# EAGLE design shebon_heart (EAGLE 7.7.0)
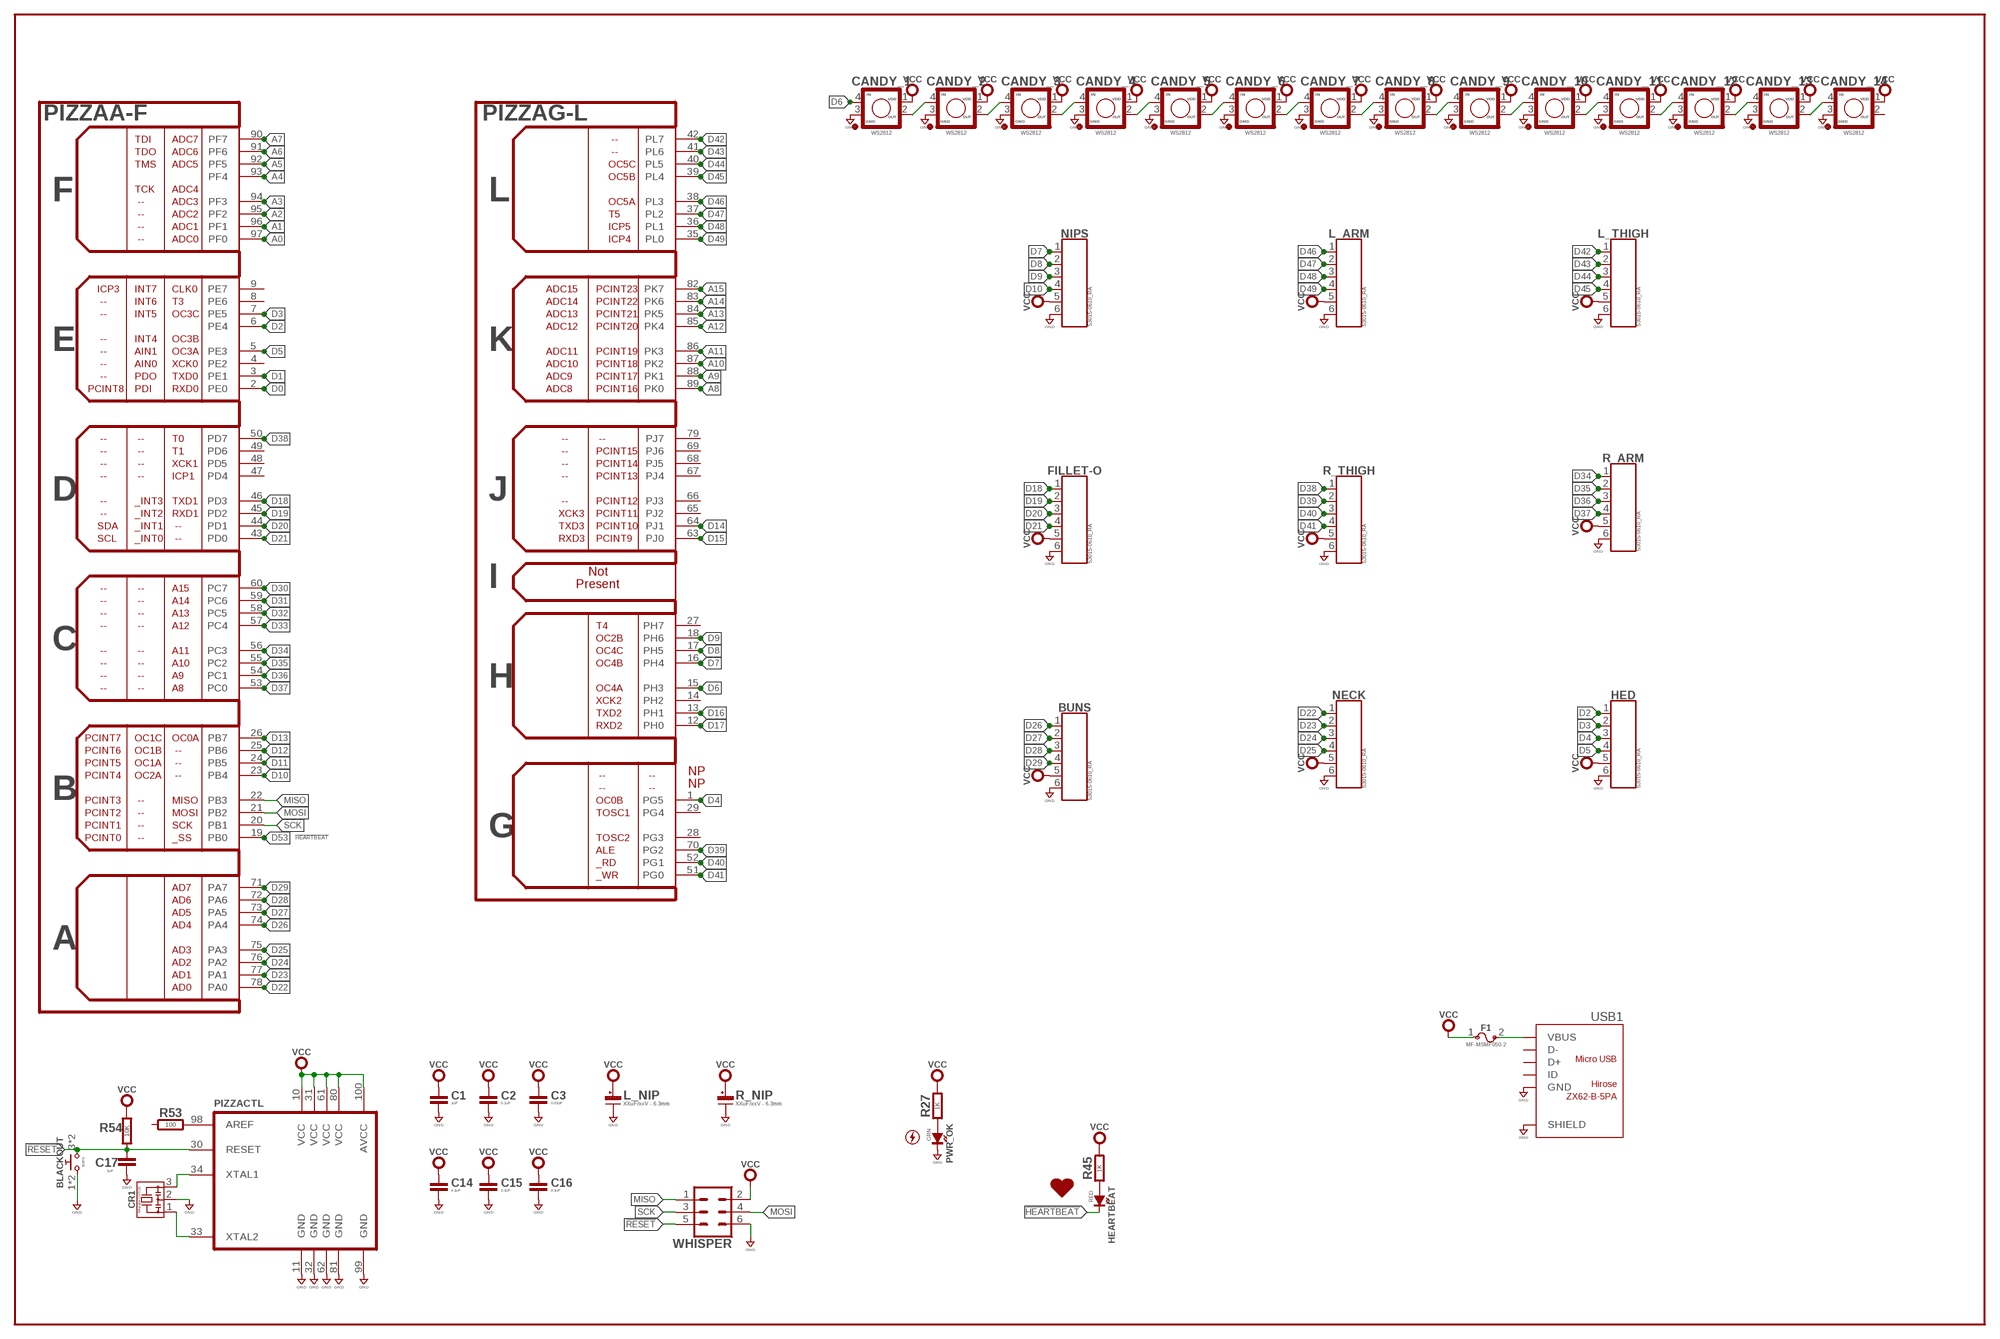
[diagram p0: schematic, sheet 1]
U$1 (TABL_L-BMG): DOCUMENT_NUMBER: BMG-IWALL-V2-A; REV: A

## Parts
BLACKOUT  B3FS  PUSHBTN-MOMB3FS  [B3FS]
BUNS  53015-0610_RA  [MICROBLADE-RA-06P]
C1  1uF  CAPACITOR0603  [0603]
C2  0.1uF  CAPACITOR0603  [0603]
C3  0.01uF  CAPACITOR0603  [0603]
C14  0.1uF  CAPACITOR0603  [0603]
C15  0.1uF  CAPACITOR0603  [0603]
C16  0.1uF  CAPACITOR0603  [0603]
C17  1uF  CAPACITOR0603  [0603]
CANDY_1  WS2812  NEOPPIXEL5X5  [NEOPIXEL]
CANDY_2  WS2812  NEOPPIXEL5X5  [NEOPIXEL]
CANDY_3  WS2812  NEOPPIXEL5X5  [NEOPIXEL]
CANDY_4  WS2812  NEOPPIXEL5X5  [NEOPIXEL]
CANDY_5  WS2812  NEOPPIXEL5X5  [NEOPIXEL]
CANDY_6  WS2812  NEOPPIXEL5X5  [NEOPIXEL]
CANDY_7  WS2812  NEOPPIXEL5X5  [NEOPIXEL]
CANDY_8  WS2812  NEOPPIXEL5X5  [NEOPIXEL]
CANDY_9  WS2812  NEOPPIXEL5X5  [NEOPIXEL]
CANDY_10  WS2812  NEOPPIXEL5X5  [NEOPIXEL]
CANDY_11  WS2812  NEOPPIXEL5X5  [NEOPIXEL]
CANDY_12  WS2812  NEOPPIXEL5X5  [NEOPIXEL]
CANDY_13  WS2812  NEOPPIXEL5X5  [NEOPIXEL]
CANDY_14  WS2812  NEOPPIXEL5X5  [NEOPIXEL]
CR1  Murata CSTCE  RESONATORMURATA-CSTCE  [MURATA_CSTCE]
F1  MF-MSMF050-2  FUSEBOURNS-MF-MSMF  [BOURNS-MF-MSMF]
FILLET-O  53015-0610_RA  [MICROBLADE-RA-06P]
HEARTBEAT  RED  SMT0603  [SMD_0603]
HED  53015-0610_RA  [MICROBLADE-RA-06P]
L_ARM  53015-0610_RA  [MICROBLADE-RA-06P]
L_NIP  XXuF/xxV - 6.3mm  CAPACITOR_POL-ALUM-SMT-6.3  [CAP_ALUM_SMT_6.3]
L_THIGH  53015-0610_RA  [MICROBLADE-RA-06P]
NECK  53015-0610_RA  [MICROBLADE-RA-06P]
NIPS  53015-0610_RA  [MICROBLADE-RA-06P]
PIZZA  ATMEGA-2560  [TQFP-100-A]
PWR_OK  GRN  SMT0603  [SMD_0603]
R27  1K  RESISTOR0603  [0603]
R45  1K  RESISTOR0603  [0603]
R53  100  RESISTOR0603  [0603]
R54  10K  RESISTOR0603  [0603]
R_ARM  53015-0610_RA  [MICROBLADE-RA-06P]
R_NIP  XXuF/xxV - 6.3mm  CAPACITOR_POL-ALUM-SMT-6.3  [CAP_ALUM_SMT_6.3]
R_THIGH  53015-0610_RA  [MICROBLADE-RA-06P]
U$2  ELECTRICITY-050X050MM  [ELECTRICITY-GLYPH-05X05MM]
U$3  HEART-05X04MM  [HEART-GLYPH-05X04MM]
USB1  ZX62-B-5PA  MICRO-USB-SMD(ZX62-B-5PA)  [MICRO-USB5+6P-SMD-0.65-AB]
WHISPER  MA03-2  [MA03-2]

## Nets
!HEARTBEAT: HEARTBEAT.K(C)
!RESET: BLACKOUT.3 BLACKOUT.4 C17.1 PIZZA.30(CTL:RESET) R54.2 WHISPER.5
A0: PIZZA.97(A-F:PF0)
A1: PIZZA.96(A-F:PF1)
A2: PIZZA.95(A-F:PF2)
A3: PIZZA.94(A-F:PF3)
A4: PIZZA.93(A-F:PF4)
A5: PIZZA.92(A-F:PF5)
A6: PIZZA.91(A-F:PF6)
A7: PIZZA.90(A-F:PF7)
A8: PIZZA.89(G-L:PK0)
A9: PIZZA.88(G-L:PK1)
A10: PIZZA.87(G-L:PK2)
A11: PIZZA.86(G-L:PK3)
A12: PIZZA.85(G-L:PK4)
A13: PIZZA.84(G-L:PK5)
A14: PIZZA.83(G-L:PK6)
A15: PIZZA.82(G-L:PK7)
D0: PIZZA.2(A-F:PE0)
D1: PIZZA.3(A-F:PE1)
D2: HED.1 PIZZA.6(A-F:PE4)
D3: HED.2 PIZZA.7(A-F:PE5)
D4: HED.3 PIZZA.1(G-L:PG5)
D5: HED.4 PIZZA.5(A-F:PE3)
D6: CANDY_1.4(OUT) PIZZA.15(G-L:PH3)
D7: NIPS.1 PIZZA.16(G-L:PH4)
D8: NIPS.2 PIZZA.17(G-L:PH5)
D9: NIPS.3 PIZZA.18(G-L:PH6)
D10: NIPS.4 PIZZA.23(A-F:PB4)
D11: PIZZA.24(A-F:PB5)
D12: PIZZA.25(A-F:PB6)
D13: PIZZA.26(A-F:PB7)
D14: PIZZA.64(G-L:PJ1)
D15: PIZZA.63(G-L:PJ0)
D16: PIZZA.13(G-L:PH1)
D17: PIZZA.12(G-L:PH0)
D18: FILLET-O.1 PIZZA.46(A-F:PD3)
D19: FILLET-O.2 PIZZA.45(A-F:PD2)
D20: FILLET-O.3 PIZZA.44(A-F:PD1)
D21: FILLET-O.4 PIZZA.43(A-F:PD0)
D22: NECK.1 PIZZA.78(A-F:PA0)
D23: NECK.2 PIZZA.77(A-F:PA1)
D24: NECK.3 PIZZA.76(A-F:PA2)
D25: NECK.4 PIZZA.75(A-F:PA3)
D26: BUNS.1 PIZZA.74(A-F:PA4)
D27: BUNS.2 PIZZA.73(A-F:PA5)
D28: BUNS.3 PIZZA.72(A-F:PA6)
D29: BUNS.4 PIZZA.71(A-F:PA7)
D30: PIZZA.60(A-F:PC7)
D31: PIZZA.59(A-F:PC6)
D32: PIZZA.58(A-F:PC5)
D33: PIZZA.57(A-F:PC4)
D34: PIZZA.56(A-F:PC3) R_ARM.1
D35: PIZZA.55(A-F:PC2) R_ARM.2
D36: PIZZA.54(A-F:PC1) R_ARM.3
D37: PIZZA.53(A-F:PC0) R_ARM.4
D38: PIZZA.50(A-F:PD7) R_THIGH.1
D39: PIZZA.70(G-L:PG2) R_THIGH.2
D40: PIZZA.52(G-L:PG1) R_THIGH.3
D41: PIZZA.51(G-L:PG0) R_THIGH.4
D42: L_THIGH.1 PIZZA.42(G-L:PL7)
D43: L_THIGH.2 PIZZA.41(G-L:PL6)
D44: L_THIGH.3 PIZZA.40(G-L:PL5)
D45: L_THIGH.4 PIZZA.39(G-L:PL4)
D46: L_ARM.1 PIZZA.38(G-L:PL3)
D47: L_ARM.2 PIZZA.37(G-L:PL2)
D48: L_ARM.3 PIZZA.36(G-L:PL1)
D49: L_ARM.4 PIZZA.35(G-L:PL0)
D53: PIZZA.19(A-F:PB0)
GND: BLACKOUT.1 BLACKOUT.2 BUNS.6 C1.2 C2.2 C3.2 C14.2 C15.2 C16.2 C17.2 CANDY_1.3(GND) CANDY_2.3(GND) CANDY_3.3(GND) CANDY_4.3(GND) CANDY_5.3(GND) CANDY_6.3(GND) CANDY_7.3(GND) CANDY_8.3(GND) CANDY_9.3(GND) CANDY_10.3(GND) CANDY_11.3(GND) CANDY_12.3(GND) CANDY_13.3(GND) CANDY_14.3(GND) CR1.2 FILLET-O.6 HED.6 L_ARM.6 L_NIP.-(N) L_THIGH.6 NECK.6 NIPS.6 PIZZA.11(CTL:GND) PIZZA.32(CTL:GND) PIZZA.62(CTL:GND) PIZZA.81(CTL:GND) PIZZA.99(CTL:GND) PWR_OK.K(C) R_ARM.6 R_NIP.-(N) R_THIGH.6 USB1.5(GND) USB1.P1(SHIELD) USB1.P2(SHIELD) USB1.P3_1(SHIELD) USB1.P3_2(SHIELD) USB1.P3_3(SHIELD) USB1.P4_1(SHIELD) USB1.P4_2(SHIELD) USB1.P4_3(SHIELD) USB1.P5(SHIELD) USB1.P6(SHIELD) WHISPER.6
MISO: PIZZA.22(A-F:PB3) WHISPER.1
MOSI: PIZZA.21(A-F:PB2) WHISPER.4
N$2: CR1.3 PIZZA.34(CTL:XTAL1)
N$3: CR1.1 PIZZA.33(CTL:XTAL2)
N$4: CANDY_1.2(IN) CANDY_2.4(OUT)
N$5: CANDY_2.2(IN) CANDY_3.4(OUT)
N$6: CANDY_3.2(IN) CANDY_4.4(OUT)
N$7: CANDY_4.2(IN) CANDY_5.4(OUT)
N$8: CANDY_5.2(IN) CANDY_6.4(OUT)
N$9: CANDY_6.2(IN) CANDY_7.4(OUT)
N$10: CANDY_7.2(IN) CANDY_8.4(OUT)
N$11: CANDY_8.2(IN) CANDY_9.4(OUT)
N$12: CANDY_9.2(IN) CANDY_10.4(OUT)
N$13: CANDY_10.2(IN) CANDY_11.4(OUT)
N$14: CANDY_11.2(IN) CANDY_12.4(OUT)
N$15: CANDY_12.2(IN) CANDY_13.4(OUT)
N$16: CANDY_13.2(IN) CANDY_14.4(OUT)
N$36: PWR_OK.A R27.1
N$41: HEARTBEAT.A R45.1
N$79: PIZZA.98(CTL:AREF) R53.2
SCK: PIZZA.20(A-F:PB1) WHISPER.3
VBUS: F1.2 USB1.1(VBUS)
VCC: BUNS.5 C1.1 C2.1 C3.1 C14.1 C15.1 C16.1 CANDY_1.1(VDD) CANDY_2.1(VDD) CANDY_3.1(VDD) CANDY_4.1(VDD) CANDY_5.1(VDD) CANDY_6.1(VDD) CANDY_7.1(VDD) CANDY_8.1(VDD) CANDY_9.1(VDD) CANDY_10.1(VDD) CANDY_11.1(VDD) CANDY_12.1(VDD) CANDY_13.1(VDD) CANDY_14.1(VDD) F1.1 FILLET-O.5 HED.5 L_ARM.5 L_NIP.+(P) L_THIGH.5 NECK.5 NIPS.5 PIZZA.10(CTL:VCC) PIZZA.31(CTL:VCC) PIZZA.61(CTL:VCC) PIZZA.80(CTL:VCC) PIZZA.100(CTL:AVCC) R27.2 R45.2 R54.1 R_ARM.5 R_NIP.+(P) R_THIGH.5 WHISPER.2
Unconnected: CANDY_14.2(IN) PIZZA.4(A-F:PE2) PIZZA.8(A-F:PE6) PIZZA.9(A-F:PE7) PIZZA.14(G-L:PH2) PIZZA.27(G-L:PH7) PIZZA.28(G-L:PG3) PIZZA.29(G-L:PG4) PIZZA.47(A-F:PD4) PIZZA.48(A-F:PD5) PIZZA.49(A-F:PD6) PIZZA.65(G-L:PJ2) PIZZA.66(G-L:PJ3) PIZZA.67(G-L:PJ4) PIZZA.68(G-L:PJ5) PIZZA.69(G-L:PJ6) PIZZA.79(G-L:PJ7) R53.1 USB1.2(D-) USB1.3(D+) USB1.4(ID)

## Notes on the sheet
- !HEARTBEAT

## Library data of the parts
BLACKOUT = switch-smd:PUSHBTN-MOM: Pushbutton Switch
BUNS FILLET-O HED L_ARM L_THIGH NECK NIPS R_ARM R_THIGH = robicon-connectors-m:5301*-0610: Molex, Microblade, 6-pin
C1-C3 C14-C17 = rlc:CAPACITOR: Capacitor CAP
CANDY_1-CANDY_14 = led:NEOPPIXEL: Adafruit NeoPixel
CR1 = ceramic-resonators:RESONATOR: resonator xtal
F1 = fuse:FUSE: Fuse
HEARTBEAT PWR_OK = led:SMT: LED SMT 0603 0805 1206
L_NIP R_NIP = rlc:CAPACITOR_POL: Polarized Capacitor
PIZZA = atmel-atmega:ATMEGA-*0: Atmel ATmega 640/1280/2560
R27 R45 R53 R54 = rlc:RESISTOR: Resistor
U$2 = gfx-glyphs:ELECTRICITY
U$3 = gfx-glyphs:HEART
USB1 = Seeed-Connector:MICRO-USB-SMD(ZX62-B-5PA): 320010005; MPN: ZX62-B-5PA
WHISPER = con-headers:MA03-2: PIN HEADER

## Board
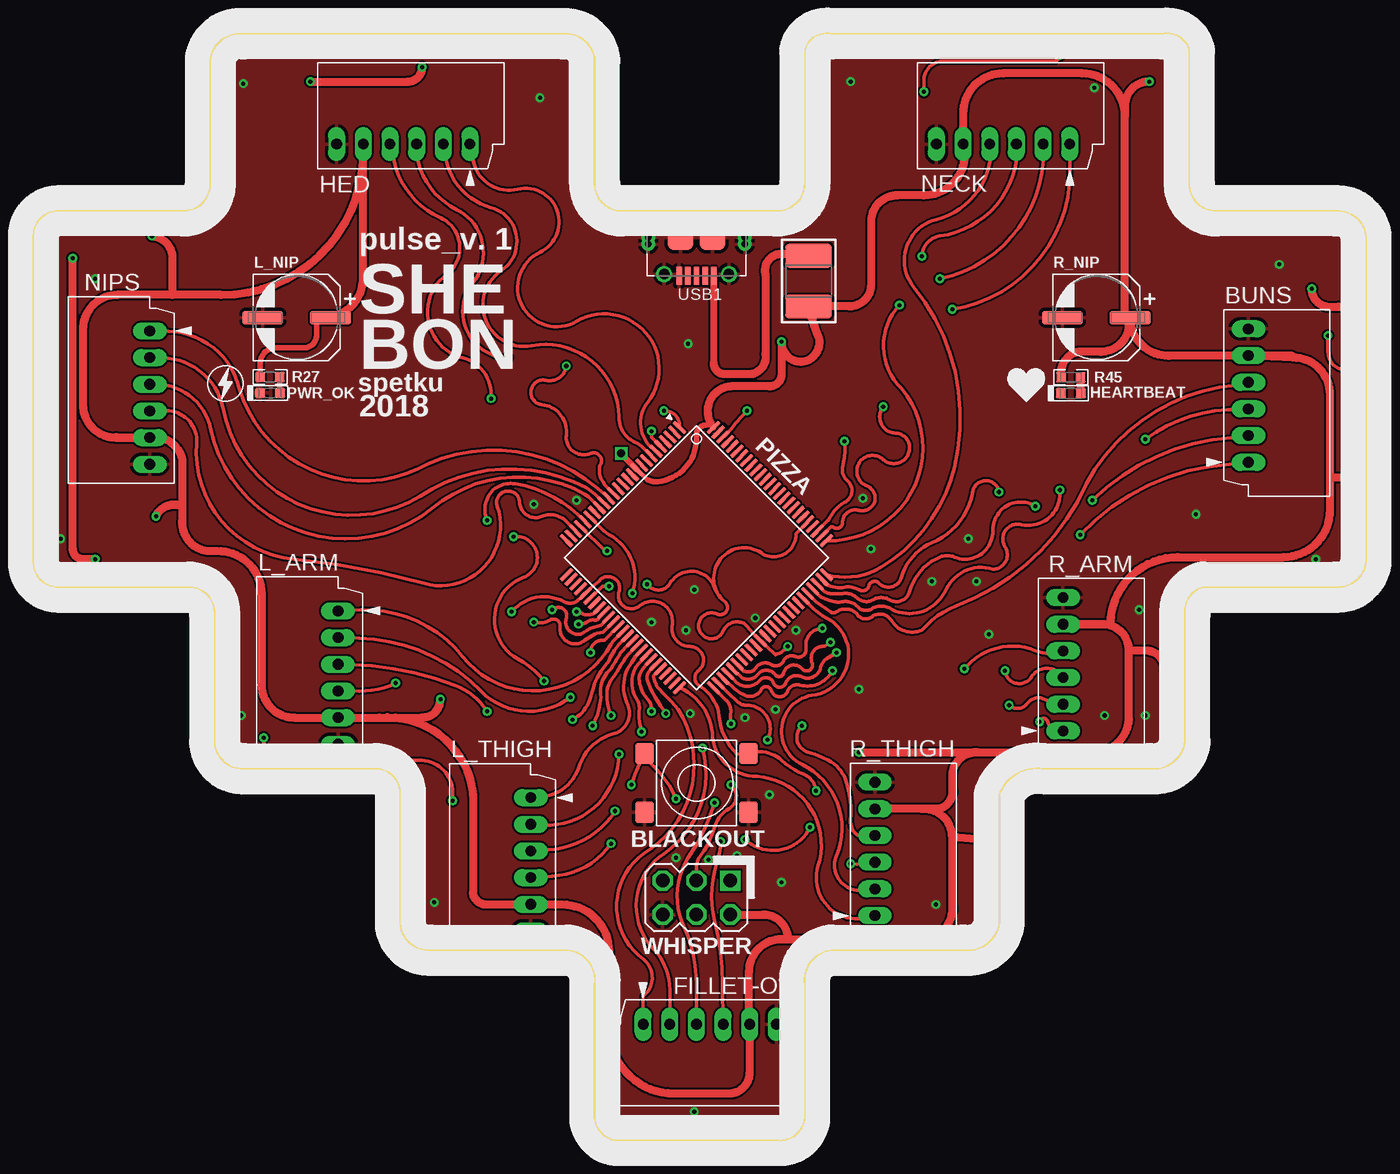
[diagram p1: board, top side]
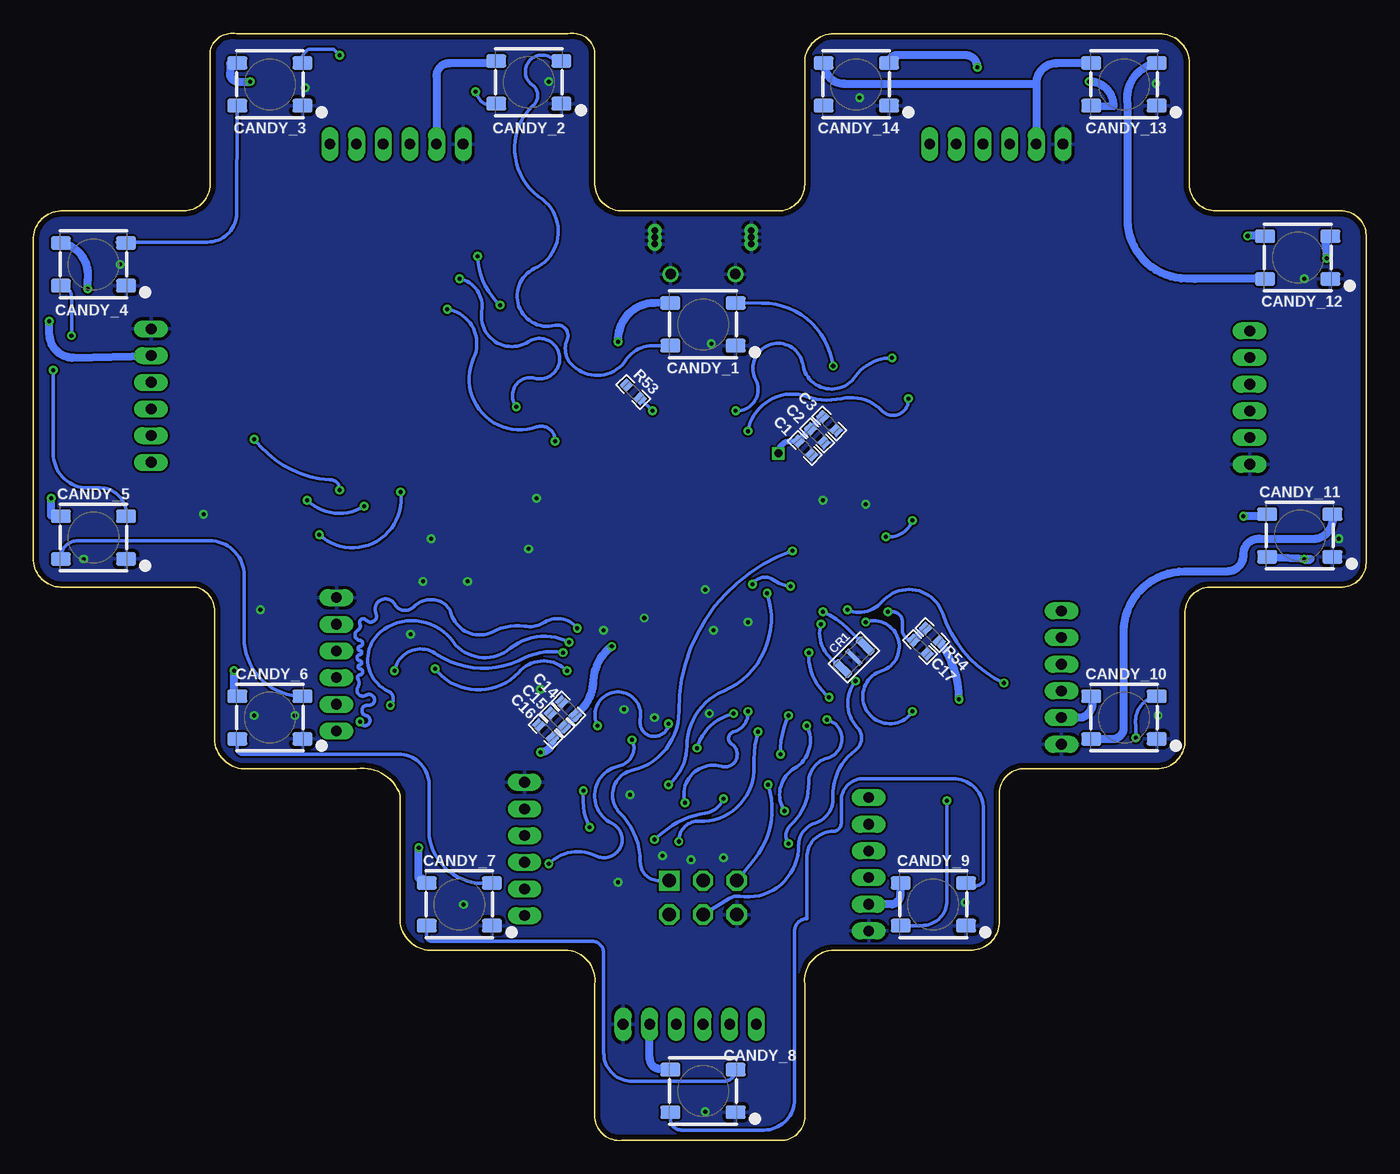
[diagram p2: board, bottom side, seen from below]

Size 100 x 83.04 mm. Coordinates in mm from the lower left corner, seen from the top.
Outline: 88.74,69.73 arc-90 86.74,71.72 86.74,81.72 arc90 84.74,83.01 59.88,83.01 arc90 57.88,81.72 57.88,71.73 arc-90 55.76,69.72 44.13,69.72 arc-90 42.13,71.73 42.13,81.01 arc90 39.76,83.01 15.76,83.01 arc90 13.27,81.01 13.27,71.72 arc-90 11.27,69.73 1.76,69.73 arc90 0,67.73 0,43.51 arc90 1.76,41.51 11.76,41.51 arc-90 13.6,39.51 13.6,29.89 arc90 15.76,27.89 25.76,27.89 arc-90 27.53,25.89 27.53,16.28 arc90 29.76,14.28 40.13,14.28 arc-90 42.13,11.72 42.13,2.01 arc90 43.76,0.01 55.88,0.01 arc90 57.88,1.72 57.88,11.72 arc-90 59.88,14.28 69.76,14.28 arc90 72.47,16.28 72.47,25.89 arc-80 75.76,27.89 83.76,27.89 arc90 86.4,29.89 86.4,39.51 arc-80 87.76,41.51 97.76,41.51 arc90 100,43.51 100,67.73 arc90 97.76,69.73 88.74,69.73
Copper layers (1*16): Top 0.0356mm / dielectric 1.5011mm / Bottom 0.0356mm
Design rules "OSH-CircuitMonkey *": minimum track width 6mil, minimum drill 12mil, track to track 6mil, track to pad 6mil, pad to pad 6mil, via to via 6mil, smd to smd 6mil, copper to edge 15mil, drill to drill 6mil, minimum pad ring 7mil, minimum via ring 7mil, stop-mask expansion 3mil, vias tented up to drill 13mil, thermal gap 10mil

### Footprints (pad centres in the part's own frame; a part is rotated, then mirrored left to right if it is on the bottom)
B3FS = smd 1.4 x 1.6: 1 3.9,-2.2; 2 -3.9,-2.2; 3 3.9,2.2; 4 -3.9,2.2
MICROBLADE-RA-06P = drill 0.8 pad 1.27 long: 1 0,0; 2 0,-2; 3 0,-4; 4 0,-6; 5 0,-8; 6 0,-10
0603 = smd 0.762 x 0.762: 1 -0.725,0; 2 0.725,0
NEOPIXEL = smd 1.5 x 1: 1 -2.45,1.6; 2 -2.45,-1.6; 3 2.45,-1.6; 4 2.45,1.6
MURATA_CSTCE = smd 0.6 x 1.6: 1 -1.2,0; 3 1.2,0 | smd 0.4 x 1.6: 2 0,0
BOURNS-MF-MSMF = smd 1.8 x 3.5: 1 -1.9,0; 2 1.9,0
SMD_0603 = smd 0.8 x 0.8: A 0.75,0; K -0.75,0
CAP_ALUM_SMT_6.3 = smd 3.048 x 1.016: + 2.54,0; - -2.54,0
TQFP-100-A = smd 1.2 x 0.28: 1 -7.8,6; 2 -7.8,5.5; 3 -7.8,5; 4 -7.8,4.5; 5 -7.8,4; 6 -7.8,3.5; 7 -7.8,3; 8 -7.8,2.5; 9 -7.8,2; 10 -7.8,1.5; 11 -7.8,1; 12 -7.8,0.5; 13 -7.8,0; 14 -7.8,-0.5; 15 -7.8,-1; 16 -7.8,-1.5; 17 -7.8,-2; 18 -7.8,-2.5; 19 -7.8,-3; 20 -7.8,-3.5; 21 -7.8,-4; 22 -7.8,-4.5; 23 -7.8,-5; 24 -7.8,-5.5; 25 -7.8,-6; 51 7.8,-6; 52 7.8,-5.5; 53 7.8,-5; 54 7.8,-4.5; 55 7.8,-4; 56 7.8,-3.5; 57 7.8,-3; 58 7.8,-2.5; 59 7.8,-2; 60 7.8,-1.5; 61 7.8,-1; 62 7.8,-0.5; 63 7.8,0; 64 7.8,0.5; 65 7.8,1; 66 7.8,1.5; 67 7.8,2; 68 7.8,2.5; 69 7.8,3; 70 7.8,3.5; 71 7.8,4; 72 7.8,4.5; 73 7.8,5; 74 7.8,5.5; 75 7.8,6 | smd 0.28 x 1.2: 26 -6,-7.8; 27 -5.5,-7.8; 28 -5,-7.8; 29 -4.5,-7.8; 30 -4,-7.8; 31 -3.5,-7.8; 32 -3,-7.8; 33 -2.5,-7.8; 34 -2,-7.8; 35 -1.5,-7.8; 36 -1,-7.8; 37 -0.5,-7.8; 38 0,-7.8; 39 0.5,-7.8; 40 1,-7.8; 41 1.5,-7.8; 42 2,-7.8; 43 2.5,-7.8; 44 3,-7.8; 45 3.5,-7.8; 46 4,-7.8; 47 4.5,-7.8; 48 5,-7.8; 49 5.5,-7.8; 50 6,-7.8; 76 6,7.8; 77 5.5,7.8; 78 5,7.8; 79 4.5,7.8; 80 4,7.8; 81 3.5,7.8; 82 3,7.8; 83 2.5,7.8; 84 2,7.8; 85 1.5,7.8; 86 1,7.8; 87 0.5,7.8; 88 0,7.8; 89 -0.5,7.8; 90 -1,7.8; 91 -1.5,7.8; 92 -2,7.8; 93 -2.5,7.8; 94 -3,7.8; 95 -3.5,7.8; 96 -4,7.8; 97 -4.5,7.8; 98 -5,7.8; 99 -5.5,7.8; 100 -6,7.8
MICRO-USB5+6P-SMD-0.65-AB = smd 0.4 x 1.35: 1 -1.3,2.875; 2 -0.65,2.875; 3 0,2.875; 4 0.65,2.875; 5 1.3,2.875 | smd 1.9 x 1.9: P1 -1.2,0; P2 1.2,0 | drill 0.508 pad 1.016: P3_1 -3.625,-0.533; P3_2 -3.625,-0.025; P3_3 -3.625,0.483; P4_1 3.625,-0.533; P4_2 3.625,-0.025; P4_3 3.625,0.483 | drill 0.8: P5 -2.425,2.73; P6 2.425,2.73
MA03-2 = drill 1.016 square: 1 -2.54,-1.27 | drill 1.016 octagon: 2 -2.54,1.27; 3 0,-1.27; 4 0,1.27; 5 2.54,-1.27; 6 2.54,1.27

### Placement (x,y rotation side)
BLACKOUT  49.76,26.82 0 top
BUNS  91.17,50.87 180 top
C1  42.11,51.95 315 bottom
C2  41.2,52.87 315 bottom
C3  40.28,53.79 315 bottom
C14  59.85,32.39 135 bottom
C15  60.69,31.54 135 bottom
C16  61.57,30.67 135 bottom
C17  33.47,37.01 315 bottom
CANDY_1  49.76,61.22 0 bottom
CANDY_2  62.82,79.37 0 bottom
CANDY_3  82.26,79.22 0 bottom
CANDY_4  95.49,65.72 0 bottom
CANDY_5  95.49,45.22 0 bottom
CANDY_6  82.26,31.72 0 bottom
CANDY_7  68.04,17.72 0 bottom
CANDY_8  49.76,3.72 0 bottom
CANDY_9  32.48,17.72 0 bottom
CANDY_10  18.17,31.72 0 bottom
CANDY_11  4.98,45.37 0 bottom
CANDY_12  5.13,66.22 0 bottom
CANDY_13  18.17,79.22 0 bottom
CANDY_14  38.26,79.22 0 bottom
CR1  38.43,36.24 225 bottom
F1  58.17,64.46 90 top
FILLET-O  45.76,8.72 90 top
HEARTBEAT  77.85,56.05 0 top
HED  32.76,74.74 270 top
L_ARM  22.87,39.72 0 top
L_NIP  19.76,61.72 0 top
L_THIGH  37.32,25.72 0 top
NECK  77.76,74.74 270 top
NIPS  8.74,60.72 0 top
PIZZA  49.76,43.72 315 top
PWR_OK  17.76,56.07 0 top
R27  17.76,57.26 180 top
R45  77.85,57.25 180 top
R53  54.99,56.15 315 bottom
R54  32.55,37.93 135 bottom
R_ARM  77.26,30.72 180 top
R_NIP  79.76,61.72 0 top
R_THIGH  63.15,16.87 180 top
U$2  14.4,56.79 0 top
U$3  74.49,56.75 0 top
USB1  49.76,67.72 180 top
WHISPER  49.76,18.22 180 top

### Tracks (layer width: path | path; a pad name or v marks a point on that pad's centre or on a via)
!RESET  (via drill 0.3)
  Top 0.254: v44.87,26.7 arc-10 BLACKOUT.4 45.86,28.75 46.7,27.91 arc-23 v48.22,25.63 | v53.4,22.58 arc107 v58.28,23.5 | v58.74,26.24 arc60 57.82,27.46 arc-18 56.14,28.52 arc61 BLACKOUT.3 52.79,28.98 arc-43 51.42,32.18 arc44 49.9,34.16 arc-103 49.9,35.23 arc139 49.29,37.06 arc-98 47.91,38.58 arc143 45.48,40.11 arc-149 43.95,41.17 arc162 42.43,41.94 arc7 PIZZA.30 41.37,41.03 40.9,40.56 arc-74 39.84,40.41 arc78 v35.88,39.65
  Bottom 0.254: WHISPER.5 45.93,21.06 arc-57 v44.87,26.7 | v48.22,25.63 arc59 49.59,24.56 arc-25 52.03,23.65 arc-10 v53.4,22.58 | v58.28,23.5 arc33 v58.74,26.24 | v35.88,39.65 35.72,39.65 arc90 34.81,39.04 34.81,38.35 arc-90 C17.1
  Bottom 0.61: R54.2 C17.1
D2
  Top 0.254: HED.1 32.98,73.79 arc99 36.33,71.35 arc-168 38.01,66.62 arc185 40.75,61.44 arc-158 46.09,55.35 arc96 PIZZA.6
D3
  Top 0.254: HED.2 30.85,74.4 arc72 34.35,69.98 arc-131 35.11,65.25 arc157 37.4,59.61 arc-99 43.95,54.28 arc74 45.32,52.3 45.63,52.09 PIZZA.7
D4  (via drill 0.3)
  Top 0.254: HED.3 28.71,74.85 arc65 31.76,69.82 arc-103 32.98,64.34 arc127 v35.57,58.7 | v47.31,54.74 arc-101 PIZZA.1
  Bottom 0.254: v35.57,58.7 arc-54 38.31,57.33 arc138 42.28,58.24 arc-198 45.78,57.02 arc119 v47.31,54.74
D5  (via drill 0.3)
  Top 0.254: HED.4 26.88,74.55 arc62 30.54,69.22 arc-119 31,64.95 arc129 32.22,58.7 arc-81 v34.35,55.65 | v46.39,53.21 46.39,52.74 PIZZA.5
  Bottom 0.254: v34.35,55.65 arc141 36.33,54.74 arc-58 39.38,55.65 arc32 41.97,55.8 arc-99 v46.39,53.21
D6  (via drill 0.3)
  Top 0.254: v39.99,58.09 arc-96 38.47,57.02 arc187 38.16,55.19 arc-91 39.99,52.91 arc120 41.82,51.54 arc-136 42.58,50.77 arc59 42.73,49.4 arc14 PIZZA.15
  Bottom 0.254: CANDY_1.4 45.32,62.81 arc83 v39.99,58.09
D7
  Top 0.254: NIPS.1 10.12,60.68 arc-76 15.45,56.41 arc103 29.63,50.77 arc-68 PIZZA.16
D8
  Top 0.254: NIPS.2 9.66,58.7 arc-79 14.23,54.89 arc111 29.02,48.34 arc-61 41.51,48.95 42.16,48.49 PIZZA.17
D9
  Top 0.254: NIPS.3 9.21,56.72 arc-78 13.32,53.37 arc117 29.93,47.42 arc-69 41.36,48.49 41.67,48.28 PIZZA.18
D10
  Top 0.254: NIPS.4 9.97,54.74 arc-95 12.25,52.3 arc89 19.57,43.61 arc-10 29.32,41.78 arc125 34.81,47.57 arc-197 36.48,47.88 arc112 38.16,46.81 arc-58 39.69,46.66 39.75,46.66 PIZZA.23
D18
  Top 0.254: FILLET-O.1 45.76,10.82 45.93,11 arc97 45.78,13.59 arc-108 45.78,21.51 arc92 48.37,32.33 arc1 46.85,34.01 arc-29 46.54,34.77 46.54,34.85 PIZZA.46
D19  (via drill 0.3)
  Top 0.254: FILLET-O.2 47.76,11.3 arc44 46.54,14.35 arc-100 47.31,21.51 arc72 v50.2,29.44 | PIZZA.45 46.24,35.23 arc65 46.09,34.47 arc17 v47.46,32.03
  Bottom 0.254: v50.2,29.44 arc62 v47.46,32.03
D20  (via drill 0.3)
  Top 0.254: FILLET-O.3 49.74,11.61 arc24 48.83,16.03 arc-57 49.13,21.21 arc17 v51.12,25.32 | v46.39,32.18 arc48 46.09,33.1 arc-37 45.48,34.47 arc-49 45.63,35.23 45.93,35.66 PIZZA.44
  Bottom 0.254: v51.12,25.32 arc121 48.37,28.07 arc-163 47.61,29.74 arc133 47.46,30.66 arc-82 v46.39,32.18
D21  (via drill 0.3)
  Top 0.254: FILLET-O.4 51.72,11.76 arc14 51.12,16.48 arc-32 51.27,20.75 arc16 v51.57,22.43 | v45.63,30.66 arc-22 45.48,32.49 arc32 45.17,33.25 arc-41 45.02,35.08 arc-28 45.48,35.84 46.01,36.37 PIZZA.43
  Bottom 0.254: v51.57,22.43 arc95 50.05,23.95 arc-95 45.93,28.07 arc18 v45.63,30.66
D22  (via drill 0.3)
  Top 0.254: NECK.1 77.79,72.72 arc-82 v68.95,62.36 | v60.87,52.45 arc-19 60.72,50.47 arc64 61.02,49.56 arc-117 60.87,47.88 arc35 59.65,46.51 59.61,46.51 PIZZA.78
  Bottom 0.254: v68.95,62.36 arc106 66.96,58.7 arc-134 62.24,53.52 arc114 v60.87,52.45
D23  (via drill 0.3)
  Top 0.254: NECK.2 75.8,74.4 arc-79 v68.03,64.64 | v63.76,55.04 arc127 64.68,53.06 arc-86 65.75,51.99 arc-134 63.76,51.08 arc201 62.55,49.1 arc-175 61.94,47.27 arc106 60.72,46.36 arc-136 59.95,46.05 59.86,46.05 PIZZA.77
  Bottom 0.254: v68.03,64.64 arc88 66.36,62.2 arc-132 62.85,59.92 arc227 62.39,57.18 arc-143 v63.76,55.04
D24  (via drill 0.3)
  Top 0.254: NECK.3 73.82,74.7 arc-84 68.03,67.84 arc81 v66.66,66.32 | v64.98,62.66 arc89 65.14,56.41 arc-132 PIZZA.76
  Bottom 0.254: v66.66,66.32 arc-46 v64.98,62.66
D25
  Top 0.254: NECK.4 71.84,74.55 arc-78 67.73,69.06 arc115 66.05,64.03 arc-53 69.1,50.47 arc-45 63.61,43 arc-47 PIZZA.75
D26  (via drill 0.3)
  Top 0.254: BUNS.1 91.35,50.77 arc48 v78.55,45.44 | v72.45,48.64 arc172 70.47,48.49 arc-55 67.42,44.83 arc51 65.14,42.24 arc-118 63.46,41.78 arc124 62.7,41.63 arc-118 61.94,41.33 arc42 60.72,41.48 arc-26 59.65,41.63 arc-44 PIZZA.74
  Bottom 0.254: v78.55,45.44 arc-142 v72.45,48.64
D27  (via drill 0.3)
  Top 0.254: BUNS.2 91.35,52.76 arc45 v79.46,48.03 | v75.19,47.57 arc123 71.99,45.75 arc-114 69.1,43.76 arc45 68.03,43.76 arc52 65.75,41.17 arc-105 64.22,40.56 arc62 63,40.56 arc-76 61.78,40.72 arc53 60.72,41.02 arc-12 59.8,41.02 arc-41 59.19,41.33 PIZZA.73
  Bottom 0.254: v79.46,48.03 arc-76 v75.19,47.57
D28  (via drill 0.3)
  Top 0.254: BUNS.3 91.5,54.74 arc44 v83.42,52.6 | v77.02,48.79 arc-109 74.13,46.2 arc136 72.91,44.53 arc-122 71.99,42.85 arc83 68.49,41.33 arc-33 67.27,39.95 arc-64 64.22,39.95 arc45 63,39.95 arc-82 61.94,39.95 arc37 61.17,40.41 arc25 60.72,40.41 arc-25 60.11,40.41 arc-12 59.19,40.72 arc-21 58.97,40.87 PIZZA.72
  Bottom 0.254: v83.42,52.6 arc-48 77.79,49.56 arc100 v77.02,48.79
D29
  Top 0.254: BUNS.4 91.5,56.72 arc62 79,49.25 arc-46 69.25,40.11 arc26 66.66,38.28 arc-85 64.37,39.04 arc85 63,39.34 arc-103 61.78,39.5 arc82 60.26,39.65 arc-71 59.8,39.65 arc1 58.72,40.41 PIZZA.71
D34  (via drill 0.3)
  Top 0.254: PIZZA.56 53.1,35.38 arc95 54.16,35.38 arc-95 55.38,35.69 arc99 56.3,35.99 arc-87 57.21,36.3 arc121 57.97,36.91 arc-97 v59.19,38.43 | v75.5,31.42 arc-154 76.11,31.42 arc92 R_ARM.1
  Bottom 0.254: v59.19,38.43 arc-82 61.63,38.89 arc43 63.15,38.58 arc-35 65.59,38.13 arc98 68.64,39.5 arc-81 70.32,40.56 arc-43 71.38,40.11 arc114 72.91,40.26 arc-173 74.28,39.5 arc159 75.04,39.04 arc-165 75.5,38.74 arc89 75.65,38.28 arc-149 75.5,37.52 arc171 75.5,37.06 arc-171 75.5,36.75 arc171 75.5,36.45 arc-171 75.5,35.99 arc171 75.5,35.69 arc-171 75.5,35.38 arc171 75.5,34.93 arc-118 75.65,34.62 arc65 75.65,34.01 arc-155 75.04,33.4 arc222 74.89,32.64 arc-177 75.04,31.88 arc244 v75.5,31.42
D35  (via drill 0.3)
  Top 0.254: PIZZA.55 53.1,34.77 arc90 54.32,34.93 arc-106 55.69,34.93 arc129 56.3,35.08 arc-126 57.67,35.38 arc163 58.43,35.84 arc-119 59.34,37.06 v59.8,37.36 | v73.21,32.64 arc94 74.58,32.79 arc-96 76.11,32.94 arc62 R_ARM.2
  Bottom 0.254: v59.8,37.36 arc-67 64.22,36.91 arc92 68.49,37.36 arc-95 73.98,38.13 arc-116 73.37,33.71 arc114 v73.21,32.64
D36  (via drill 0.3)
  Top 0.254: v72.91,35.23 arc142 74.89,34.77 arc-119 R_ARM.3 | v60.26,36.6 59.5,36.14 arc38 59.04,35.38 arc-98 57.67,34.77 arc98 56.45,34.32 arc-139 55.53,34.32 arc123 54.47,34.47 arc-94 52.64,34.47 arc3 PIZZA.54
  Bottom 0.254: v60.26,36.6 arc-39 63.61,35.99 arc58 69.71,36.45 arc-117 v72.91,35.23
D37  (via drill 0.3)
  Top 0.254: v69.86,35.38 arc-72 75.19,36.75 arc42 R_ARM.4 | PIZZA.53 52.49,34.01 arc29 53.4,33.4 arc94 54.62,33.86 arc-137 55.38,33.71 arc137 56.6,33.71 arc-84 57.52,34.16 arc78 v59.95,35.23
  Bottom 0.254: v59.95,35.23 arc-96 63.61,35.08 arc98 v69.86,35.38
D38
  Top 0.254: R_THIGH.1 61.94,16.64 arc-110 58.89,20.6 arc104 54.32,27.31 arc-82 50.96,30.2 arc67 PIZZA.50
D39
  Top 0.254: R_THIGH.2 61.94,18.77 arc-111 60.26,21.36 arc87 57.67,28.22 arc-145 58.43,33.4 arc153 59.19,39.34 58.58,39.84 PIZZA.70
D40  (via drill 0.3)
  Top 0.254: R_THIGH.3 61.81,20.72 v61.33,20.75 | PIZZA.52 52.15,33.55 52.79,32.94 arc43 53.55,32.64 arc-119 v55.08,30.05
  Bottom 0.254: v61.33,20.75 arc73 57.82,21.36 arc-182 56.6,23.8 arc141 56.14,28.07 arc-107 v55.08,30.05
D41  (via drill 0.3)
  Top 0.254: R_THIGH.4 62.39,22.73 arc-91 61.33,23.95 arc20 61.02,26.85 arc46 59.65,28.52 arc12 58.13,29.13 arc-122 v57.67,31.12 | v52.33,31.27 arc-12 52.33,32.18 arc59 51.88,33.1 51.74,33.25 PIZZA.51
  Bottom 0.254: v57.67,31.12 arc220 54.47,31.57 arc-184 v52.33,31.27
D42
  Top 0.254: L_THIGH.1 38.01,25.78 arc69 40.9,27.91 arc-58 43.5,30.51 arc105 44.56,32.79 arc-60 44.87,35.84 45.17,36.31 PIZZA.42
D43  (via drill 0.3)
  Top 0.254: L_THIGH.2 38.31,23.65 arc91 v43.95,28.98 | PIZZA.41 44.87,36.71 arc17 44.1,35.69 arc-5 43.65,34.93 arc47 43.04,33.4 arc19 v43.34,31.88
  Bottom 0.254: v43.95,28.98 arc26 v43.34,31.88
D44  (via drill 0.3)
  Top 0.254: L_THIGH.3 38.62,21.82 arc55 v43.65,24.71 | v41.97,31.12 arc23 42.58,33.25 arc-60 43.34,35.38 arc5 43.8,36.14 arc-16 44.41,36.96 PIZZA.40
  Bottom 0.254: v43.65,24.71 arc92 42.89,27.91 arc-87 v41.97,31.12
D45  (via drill 0.3)
  Top 0.254: L_THIGH.4 38.92,19.84 arc53 v43.34,22.28 | v40.45,31.57 arc48 41.82,33.25 arc-2 42.12,34.32 arc-16 43.19,35.99 arc-4 43.5,36.6 arc-16 43.95,37.21 PIZZA.39
  Bottom 0.254: v43.34,22.28 arc82 43.19,23.65 arc-48 41.82,26.85 arc76 40.45,28.68 arc-150 v40.45,31.57
D46
  Top 0.254: L_ARM.1 24.6,39.8 arc-53 32.22,36.3 arc114 43.34,37.21 43.5,37.46 PIZZA.38
D47  (via drill 0.3)
  Top 0.254: L_ARM.2 24.45,37.67 arc-44 33.59,33.71 arc83 v40.29,33.25 | v41.82,36.6 arc-97 42.73,37.52 42.84,37.52 PIZZA.37
  Bottom 0.254: v40.29,33.25 arc56 v41.82,36.6
D48  (via drill 0.3)
  Top 0.254: L_ARM.3 23.84,35.69 arc-20 31.61,34.16 arc-36 v34.05,32.18 | v37.55,38.89 arc47 38.77,39.04 arc-123 39.53,38.58 arc140 41.36,37.52 arc-32 42.73,38.13 42.75,38.13 PIZZA.36
  Bottom 0.254: v34.05,32.18 arc220 36.33,35.23 arc-179 v37.55,38.89
D49  (via drill 0.3)
  Top 0.254: L_ARM.4 24.45,33.71 arc26 v27.19,34.32 | v38.92,39.8 39.23,39.95 arc-127 39.99,39.19 arc117 41.06,37.97 arc-6 41.82,38.43 42.58,38.67 PIZZA.35
  Bottom 0.254: v27.19,34.32 arc46 31.76,39.5 arc-121 36.33,40.41 arc72 v38.92,39.8
GND  (via drill 0.3)
  other vias: 37.55,47.73 46.39,38.89 49.59,41.33 48.98,38.28 67.42,41.94 55.69,32.33 53.4,31.72 49.29,32.03 62.24,48.18 40.75,48.03 48.22,21.21 50.66,21.06 55.23,25.93 52.79,21.36 56.14,19.38 54.16,39.19 57.21,38.28 61.94,33.86 71.69,37.97 70.77,41.94 70.16,45.14 62.85,44.37 83.42,31.88 67.73,17.7 49.59,2.16 30.08,17.86 15.61,31.88 2.04,45.14 4.63,64.64 15.76,79.27 38.01,78.21 49.13,59.77 61.33,79.43 79.61,78.97 93.48,65.71 96.23,43.61 87.23,46.96 82.97,39.8 80.38,31.88
  pour Bottom: 0,0.01 0,83.01 100,83.01 100,0.01
  pour Top: 0,0.01 0,83.01 100,83.01 100,0.01
MISO  (via drill 0.3)
  Top 0.254: v43.04,44.22 42.89,44.22 PIZZA.22
  Bottom 0.254: WHISPER.1 53.05,19.49 arc90 54.47,20.9 arc-45 55.99,24.56 arc122 55.08,27.76 arc-77 51.57,32.18 arc71 v43.04,44.22
MOSI  (via drill 0.3)
  Top 0.254: v38.31,34.47 arc22 36.33,36.14 arc-130 36.79,42.24 arc167 v36.03,45.29 | v34.05,46.51 arc-68 34.5,48.79 arc-51 36.18,49.25 arc-38 PIZZA.21
  Bottom 0.254: WHISPER.4 47.76,18.16 arc40 47,18.31 arc-99 42.58,22.12 arc72 41.36,23.8 arc-75 39.99,25.78 arc57 38.31,29.29 arc-98 38.16,30.96 arc82 v38.31,34.47 | v36.03,45.29 arc-78 v34.05,46.51
N$2  (via drill 0.3)
  Top 0.254: v40.9,38.74 41.06,38.74 arc37 41.51,38.89 arc-46 42.12,39.04 arc71 42.43,39.19 arc-30 PIZZA.34
  Bottom 0.254: CR1.3 40.14,36.14 arc65 v40.9,38.74
N$3  (via drill 0.3)
  Top 0.254: v40.75,39.65 arc-45 41.21,39.5 arc86 PIZZA.33
  Bottom 0.254: CR1.1 38.47,37.97 arc-22 v40.75,39.65
N$4
  Bottom 0.254: CANDY_1.2 53.55,59.61 arc-56 55.53,58.55 arc104 59.65,58.24 arc65 59.95,60.07 arc-128 60.87,61.14 arc170 62.39,65.41 arc-117 61.78,70.59 arc103 62.55,77.6 arc-113 62.7,79.27 arc187 60.87,80.95 arc-63 CANDY_2.4
N$5  (via drill 0.3)
  Top 0.254: v66.81,78.66 66.81,79.58 arc-90 68.34,80.95 76.57,80.95 arc90 v77.02,81.41
  Bottom 0.254: CANDY_2.2 65.16,77.62 arc90 v66.81,78.66 | v77.02,81.41 77.48,81.86 79.26,81.86 arc-90 CANDY_3.4
N$6
  Bottom 0.254: CANDY_3.2 84.75,69.57 arc90 86.93,67.39 93.74,67.39 arc-90 CANDY_4.4
N$7  (via drill 0.3)
  Top 0.254: v97.14,60.38 97.14,59.16 arc90 v98.51,57.79
  Bottom 0.254: CANDY_4.2 97.99,64.12 arc90 97.14,63.27 v97.14,60.38 | v98.51,57.79 98.51,51.54 arc-90 95.92,48.95 95.16,48.95 arc90 93.03,47.12 93.03,46.84 arc90 CANDY_5.4
N$8
  Bottom 0.254: CANDY_5.2 97.94,43.72 arc90 96.68,44.98 86.78,44.98 arc90 84.19,42.39 84.19,37.7 arc-90 CANDY_6.4
N$9
  Bottom 0.254: CANDY_6.2 84.71,29.35 arc-90 84.34,28.98 72.6,28.98 arc90 70.32,26.7 70.32,22.83 arc-90 CANDY_7.4
N$10
  Bottom 0.254: CANDY_7.2 70.49,15.28 arc-90 70.17,14.96 58.13,14.96 arc90 57.21,14.05 57.21,6.58 arc-90 55.08,4.45 48.18,4.45 arc-90 CANDY_8.4
N$11
  Bottom 0.254: CANDY_8.2 52.21,1.57 arc-90 51.42,0.79 45.17,0.79 arc-90 42.89,3.07 42.89,15.72 arc90 41.97,16.64 41.97,21.21 arc90 39.99,23.19 arc-90 39.38,23.8 39.38,25.48 arc90 37.7,27.15 31,27.15 arc90 28.71,24.87 28.71,19.41 arc90 CANDY_9.4
N$12  (via drill 0.3)
  Top 0.254: v31.46,25.48 31.46,25.93 arc90 29.17,28.52 18.81,28.52 arc-90 v17.28,30.2
  Bottom 0.254: CANDY_9.2 33.34,16.12 arc-90 31.46,18.01 v31.46,25.48 | v17.28,30.2 17.28,31.15 arc90 CANDY_10.4
N$13
  Bottom 0.61: CANDY_10.2 19.04,30.12 arc-90 18.2,30.96 18.2,38.13 arc90 13.62,42.7 10.42,42.7 arc-90 9.21,43.92 9.21,44.07 arc90 7.99,45.14 3.75,45.14 arc-90 CANDY_11.4
N$14  (via drill 0.3)
  Top 0.61: v4.63,43.61 3.72,43.61 arc-90 2.96,44.37 v2.96,66.17
  Bottom 0.61: CANDY_11.2 4.18,43.62 arc90 v4.63,43.61 | v2.96,66.17 2.96,66.93 arc90 CANDY_12.4
N$15
  Bottom 0.61: CANDY_12.2 12.84,64.62 arc90 12.86,64.64 13.47,64.64 arc90 17.89,69.06 17.89,77.74 arc90 CANDY_13.4
N$16  (via drill 0.3)
  Top 0.61: v20.79,79.43 28.1,79.43 arc90 v29.17,80.49
  Bottom 0.61: CANDY_13.2 18.94,77.58 arc-90 v20.79,79.43 | v29.17,80.49 arc-90 30.08,81.41 35.22,81.41 arc-90 CANDY_14.4
N$36
  Top 0.406: R27.1 18.48,56.09 arc90 PWR_OK.A
N$41
  Top 0.61: R45.1 78.57,56.08 arc90 HEARTBEAT.A
N$79  (via drill 0.3)
  Top 0.254: v53.55,54.74 arc8 52.33,53.37 arc-15 PIZZA.98
  Bottom 0.254: R53.2 v53.55,54.74
SCK  (via drill 0.3)
  Top 0.254: WHISPER.3 49.74,20.45 arc-38 50.05,21.36 arc22 51.12,23.5 arc-45 52.18,24.87 arc111 v52.33,26.7 | v44.94,41.05 arc82 43.19,45.44 42.78,45.75 PIZZA.20
  Bottom 0.254: v52.33,26.7 arc-51 50.96,29.59 arc67 48.22,33.71 arc-86 v44.94,41.05
VBUS
  Top 0.508: 51.06,58.3 USB1.1
  Top 0.61: F1.2 arc90 58.05,66.47 55.84,66.47 arc90 54.93,64.95 54.93,59 arc-90 53.86,57.48 51.88,57.48 arc-90 51.06,58.3
VCC  (via drill 0.3, 0.6)
  Top 0.254: 50.81,53.82 arc25 PIZZA.100 | v56.6,37.06 arc-35 55.69,36.45 55,37.06 PIZZA.61 54.01,38.05 53.55,38.58 53.4,38.74 arc104 51.72,38.13 arc-264 51.27,39.5 arc168 51.88,40.41 | PIZZA.80 57.21,45.52 57.21,45.44 arc-124 54.62,44.07 arc175 51.88,40.41 | PIZZA.31 42.72,41.58 v43.19,41.58 | v46.04,41.73 arc114 47.76,41.78 arc-129 51.12,41.48 arc26 51.88,40.41 | 69.8,74.55 69.8,74.69 NECK.5
  Top 0.356: 46.09,49.56 PIZZA.10
  Top 0.406: R27.2 17.03,58.3 arc-90 18.2,59.46 20.33,59.46 arc90 21.24,60.38 21.24,61.67 arc-90 L_NIP.+ | v44.1,51.54 44.1,51.49 PIZZA.10 | PIZZA.100 arc90 50.84,53.67 50.51,53.67 arc90 49.74,52.91 49.74,52.6 arc-90 46.54,49.4 46.09,49.56 | 34.64,17.72 34.5,17.72 34.5,17.7
  Top 0.61: 10.42,63.42 14.08,63.42 arc93 HED.5 arc90 24.75,74.58 24.75,64.64 arc-90 21.68,61.72 L_NIP.+ | 10.42,63.42 6.31,63.42 arc90 3.72,60.83 3.72,55.19 arc90 6.19,52.72 | 6.19,52.72 NIPS.5 | 6.19,52.72 arc-90 6.23,52.76 8.44,52.76 arc-90 11.19,51.08 11.19,47.57 | 25.97,31.72 22.26,31.72 arc90 L_ARM.5 19.57,31.72 arc-90 17.13,34.16 17.13,41.02 arc90 13.78,44.22 13.02,44.22 arc-90 11.19,46.66 11.19,47.57 | 25.97,31.72 arc-90 32.98,25.93 32.98,18.62 arc90 34.05,17.7 34.5,17.7 39.69,17.7 arc-90 43.19,14.2 43.19,8.41 arc90 48.07,3.53 52.18,3.53 arc90 53.76,5.11 FILLET-O.5 arc-90 53.71,8.77 53.71,12.67 arc-90 56.14,15.11 56.6,15.11 | 34.64,17.72 L_THIGH.5 | 56.6,15.11 66.96,15.11 arc90 68.95,17.7 68.95,22.73 | 68.95,22.73 arc90 66.81,24.87 66.66,24.87 | 70.77,29.13 arc90 68.95,27.31 68.95,26.39 arc-90 67.88,24.87 66.66,24.87 | 70.77,29.13 79.31,29.13 arc90 82.2,31.57 82.2,36.75 | 82.2,36.75 arc90 80.24,38.72 R_ARM.5 arc-90 77.27,38.74 80.83,38.74 arc-90 85.86,43.76 93.79,43.76 arc90 97.29,47.27 97.29,49.71 | 97.29,49.71 97.29,55.96 arc90 94.53,58.72 | 94.53,58.72 BUNS.5 | 94.53,58.72 arc90 94.4,58.85 85.17,58.85 arc-90 R_NIP.+ | 81.9,76.84 81.9,62.12 arc90 R_NIP.+ | 81.9,76.84 arc90 78.7,80.04 72.76,80.04 arc90 69.76,77.04 NECK.5 | 69.8,74.55 69.86,73.94 arc-90 66.81,70.89 64.83,70.89 arc90 62.85,68.91 62.85,64.19 arc-90 61.22,62.56 F1.1 arc7 58.89,60.38 arc-205 v56.14,59.92 56.14,57.48 arc-90 55.23,56.57 52.33,56.57 arc114 50.81,53.82 | v8.9,67.84 arc-90 10.42,66.01 10.42,63.42 | v9.21,46.81 arc-90 11.19,47.57 | v71.08,21.97 arc90 70.77,22.58 68.95,22.73
  Top 0.61: v84.95,35.23 arc90 83.42,36.75 82.2,36.75 | v98.66,48.18 98.66,49.25 arc90 98.21,49.71 97.29,49.71 | v83.73,79.43 arc90 81.9,77.6 81.9,76.84 | WHISPER.2 54.76,16.95 arc-90 56.6,15.11 | 25.97,31.72 29.17,31.72 arc90 v30.54,33.1 | v61.94,29.13 70.77,29.13 | v98.82,61.44 arc113 97.75,62.51 97.29,62.51 arc-90 v95.92,63.88 | 66.66,24.87 R_THIGH.5 | R_NIP.+ arc90 82.2,61.63 82.2,61.29 arc-90 80.07,59.16 78.42,59.16 arc90 R45.2
  Bottom 0.254: v43.19,41.58 arc33 44.61,42.14 arc-86 v46.04,41.73
  Bottom 0.406: v44.1,51.54 arc90 43.18,52.46 C1.1 C2.1 C3.1
  Bottom 0.61: CANDY_13.1 arc90 20.8,80.8 23.23,80.8 arc-90 24.76,79.27 | 24.76,79.27 HED.5 | CANDY_14.1 arc-90 39.15,79.27 24.76,79.27 | CANDY_12.1 arc-90 8.21,67.84 v8.9,67.84 | CANDY_11.1 arc90 8.04,46.81 v9.21,46.81 | CANDY_10.1 arc90 21.31,31.72 L_ARM.5 | CANDY_9.1 arc-90 34.96,19.29 34.96,18.62 arc90 35.55,17.72 L_THIGH.5 | CANDY_8.1 arc-90 52.25,5.36 52.94,5.36 arc90 53.76,6.17 FILLET-O.5 | CANDY_7.1 arc-90 71.08,19.64 v71.08,21.97 | CANDY_6.1 arc90 84.95,33.56 v84.95,35.23 | CANDY_5.1 arc-90 98.66,46.86 v98.66,48.18 | 97.9,67.36 arc90 CANDY_4.1 arc90 95.92,64.54 v95.92,63.88 | BUNS.5 97.01,58.72 arc90 98.82,60.53 v98.82,61.44 | CANDY_3.1 arc-90 85.25,80.77 85.25,80.04 arc-90 84.64,79.43 v83.73,79.43 | CANDY_2.1 arc90 65.91,80.8 68.79,80.8 arc-90 69.76,79.83 NECK.5 | CANDY_1.1 53.4,62.81 arc-92 v56.14,59.92 | v30.54,33.1 arc-38 R54.1 | v56.6,37.06 arc-52 57.97,34.47 arc43 58.89,32.33 C14.1 C15.1 C16.1 61.06,30.01 arc90 v61.94,29.13

### Text on the board
tPlace: pulse_v. 1 | SHE | BON | spetku | 2018